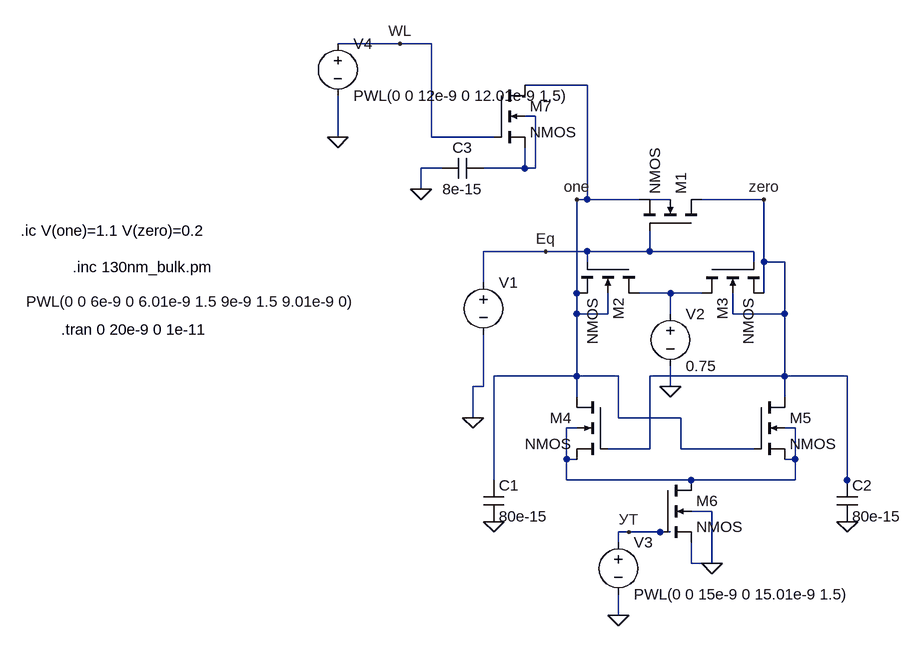
[diagram p0: schematic amplifaer.asc]
amplifaer.asc, the LTspice schematic file:
Version 4
SHEET 1 880 680
WIRE -112 -256 -208 -256
WIRE -64 -256 -112 -256
WIRE 176 -192 80 -192
WIRE 96 -144 80 -144
WIRE -208 -112 -208 -176
WIRE -64 -112 -64 -256
WIRE 32 -112 -64 -112
WIRE -48 -64 -80 -64
WIRE 80 -64 80 -96
WIRE 80 -64 16 -64
WIRE 96 -64 96 -144
WIRE 96 -64 80 -64
WIRE -80 -32 -80 -64
WIRE 176 -16 176 -192
WIRE 176 -16 160 -16
WIRE 256 -16 176 -16
WIRE 304 -16 272 -16
WIRE 448 -16 352 -16
WIRE 112 64 16 64
WIRE 176 64 112 64
WIRE 272 64 272 32
WIRE 272 64 176 64
WIRE 432 64 272 64
WIRE 176 80 176 64
WIRE 432 80 432 64
WIRE 448 80 448 -16
WIRE 480 80 448 80
WIRE 16 112 16 64
WIRE 160 128 160 -16
WIRE 304 128 256 128
WIRE 352 128 304 128
WIRE 448 128 448 80
WIRE 160 160 160 128
WIRE 208 160 208 128
WIRE 208 160 160 160
WIRE 304 160 304 128
WIRE 400 160 400 128
WIRE 480 160 480 80
WIRE 480 160 400 160
WIRE 160 256 160 160
WIRE 160 256 32 256
WIRE 224 256 160 256
WIRE 480 256 480 160
WIRE 480 256 272 256
WIRE 576 256 480 256
WIRE 16 272 16 192
WIRE 16 272 0 272
WIRE 304 272 304 240
WIRE 160 288 160 256
WIRE 480 288 480 256
WIRE 0 320 0 272
WIRE 224 320 224 256
WIRE 320 320 224 320
WIRE 160 336 144 336
WIRE 496 336 480 336
WIRE 272 368 272 256
WIRE 272 368 208 368
WIRE 320 368 320 320
WIRE 432 368 320 368
WIRE 144 384 144 336
WIRE 160 384 144 384
WIRE 496 384 496 336
WIRE 496 384 480 384
WIRE 32 416 32 256
WIRE 144 416 144 384
WIRE 336 416 144 416
WIRE 496 416 496 384
WIRE 496 416 336 416
WIRE 576 416 576 256
WIRE 576 432 576 416
WIRE 368 464 336 464
WIRE 240 496 224 496
WIRE 288 496 240 496
WIRE 304 496 288 496
WIRE 224 512 224 496
WIRE 336 544 336 512
WIRE 368 544 368 464
WIRE 368 544 336 544
WIRE 224 624 224 592
FLAG 0 320 0
FLAG 160 -16 one
FLAG 448 -16 zero
FLAG 304 272 0
FLAG 576 480 0
FLAG 32 480 0
FLAG 368 544 0
FLAG 224 624 0
FLAG -80 -32 0
FLAG -208 -112 0
FLAG 112 64 Eq
FLAG 240 496 УТ
FLAG -112 -256 WL
SYMBOL nmos4 352 32 M270
SYMATTR InstName M1
SYMATTR Value2 l=130e-9 w=1300e-9 ad=676000e-18 as=676000e-18 pd=3640e-9 ps=3640e-9
SYMBOL nmos4 256 80 R90
SYMATTR InstName M2
SYMATTR Value2 l=130e-9 w=1300e-9 ad=676000e-18 as=676000e-18 pd=3640e-9 ps=3640e-9
SYMBOL nmos4 352 80 M90
SYMATTR InstName M3
SYMATTR Value2 l=130e-9 w=1300e-9 ad=676000e-18 as=676000e-18 pd=3640e-9 ps=3640e-9
SYMBOL voltage 16 96 R0
WINDOW 3 -704 45 Left 2
WINDOW 123 0 0 Left 0
WINDOW 39 0 0 Left 0
SYMATTR InstName V1
SYMATTR Value PWL(0 0 6e-9 0 6.01e-9 1.5 9e-9 1.5 9.01e-9 0)
SYMBOL voltage 304 144 R0
WINDOW 123 0 0 Left 0
WINDOW 39 0 0 Left 0
SYMATTR InstName V2
SYMATTR Value 0.75
SYMBOL cap 16 416 R0
SYMATTR InstName C1
SYMATTR Value 80e-15
SYMBOL cap 560 416 R0
SYMATTR InstName C2
SYMATTR Value 80e-15
SYMBOL nmos4 208 288 M0
SYMATTR InstName M4
SYMATTR Value2 l=130e-9 w=1300e-9 ad=676000e-18 as=676000e-18 pd=3640e-9 ps=3640e-9
SYMBOL nmos4 432 288 R0
SYMATTR InstName M5
SYMATTR Value2 l=130e-9 w=1300e-9 ad=676000e-18 as=676000e-18 pd=3640e-9 ps=3640e-9
SYMBOL nmos4 288 416 R0
SYMATTR InstName M6
SYMATTR Value2 l=130e-9 w=1300e-9 ad=676000e-18 as=676000e-18 pd=3640e-9 ps=3640e-9
SYMBOL voltage 224 496 R0
WINDOW 123 0 0 Left 0
WINDOW 39 0 0 Left 0
SYMATTR InstName V3
SYMATTR Value PWL(0 0 15e-9 0 15.01e-9 1.5)
SYMBOL nmos4 32 -192 R0
SYMATTR InstName M7
SYMATTR Value2 l=130e-9 w=1300e-9 ad=676000e-18 as=676000e-18 pd=3640e-9 ps=3640e-9
SYMBOL cap 16 -80 R90
WINDOW 0 0 32 VBottom 2
WINDOW 3 32 32 VTop 2
SYMATTR InstName C3
SYMATTR Value 8e-15
SYMBOL voltage -208 -272 R0
WINDOW 123 0 0 Left 0
WINDOW 39 0 0 Left 0
SYMATTR InstName V4
SYMATTR Value PWL(0 0 12e-9 0 12.01e-9 1.5)
TEXT -616 88 Left 2 !.inc 130nm_bulk.pm
TEXT -634 184 Left 2 !.tran 0 20e-9 0 1e-11
TEXT -696 32 Left 2 !.ic V(one)=1.1 V(zero)=0.2

The netlist it stands for:
* amplifaer.asc
M1 zero Eq one N002 NMOS l=130e-9 w=1300e-9 ad=676000e-18 as=676000e-18 pd=3640e-9 ps=3640e-9
M2 N003 Eq one one NMOS l=130e-9 w=1300e-9 ad=676000e-18 as=676000e-18 pd=3640e-9 ps=3640e-9
M3 N003 Eq zero zero NMOS l=130e-9 w=1300e-9 ad=676000e-18 as=676000e-18 pd=3640e-9 ps=3640e-9
V1 Eq 0 PWL(0 0 6e-9 0 6.01e-9 1.5 9e-9 1.5 9.01e-9 0)
V2 N003 0 0.75
C1 one 0 80e-15
C2 zero 0 80e-15
M4 one zero N004 N004 NMOS l=130e-9 w=1300e-9 ad=676000e-18 as=676000e-18 pd=3640e-9 ps=3640e-9
M5 zero one N004 N004 NMOS l=130e-9 w=1300e-9 ad=676000e-18 as=676000e-18 pd=3640e-9 ps=3640e-9
M6 N004 УТ 0 0 NMOS l=130e-9 w=1300e-9 ad=676000e-18 as=676000e-18 pd=3640e-9 ps=3640e-9
V3 УТ 0 PWL(0 0 15e-9 0 15.01e-9 1.5)
M7 one WL N001 N001 NMOS l=130e-9 w=1300e-9 ad=676000e-18 as=676000e-18 pd=3640e-9 ps=3640e-9
C3 N001 0 8e-15
V4 WL 0 PWL(0 0 12e-9 0 12.01e-9 1.5)
.model NMOS NMOS
.model PMOS PMOS
.lib standard.mos
.inc 130nm_bulk.pm
.tran 0 20e-9 0 1e-11
.ic V(one)=1.1 V(zero)=0.2
.backanno
.end